# EasyEDA schematic ESP32 MATRIX ULN2002.json
TITLE: Sheet_1; REV: 1.0; Date: 2022-03-14; Sheet: 1/1; Drawn By: Toàn Nguyễn Văn; Company: Your Company
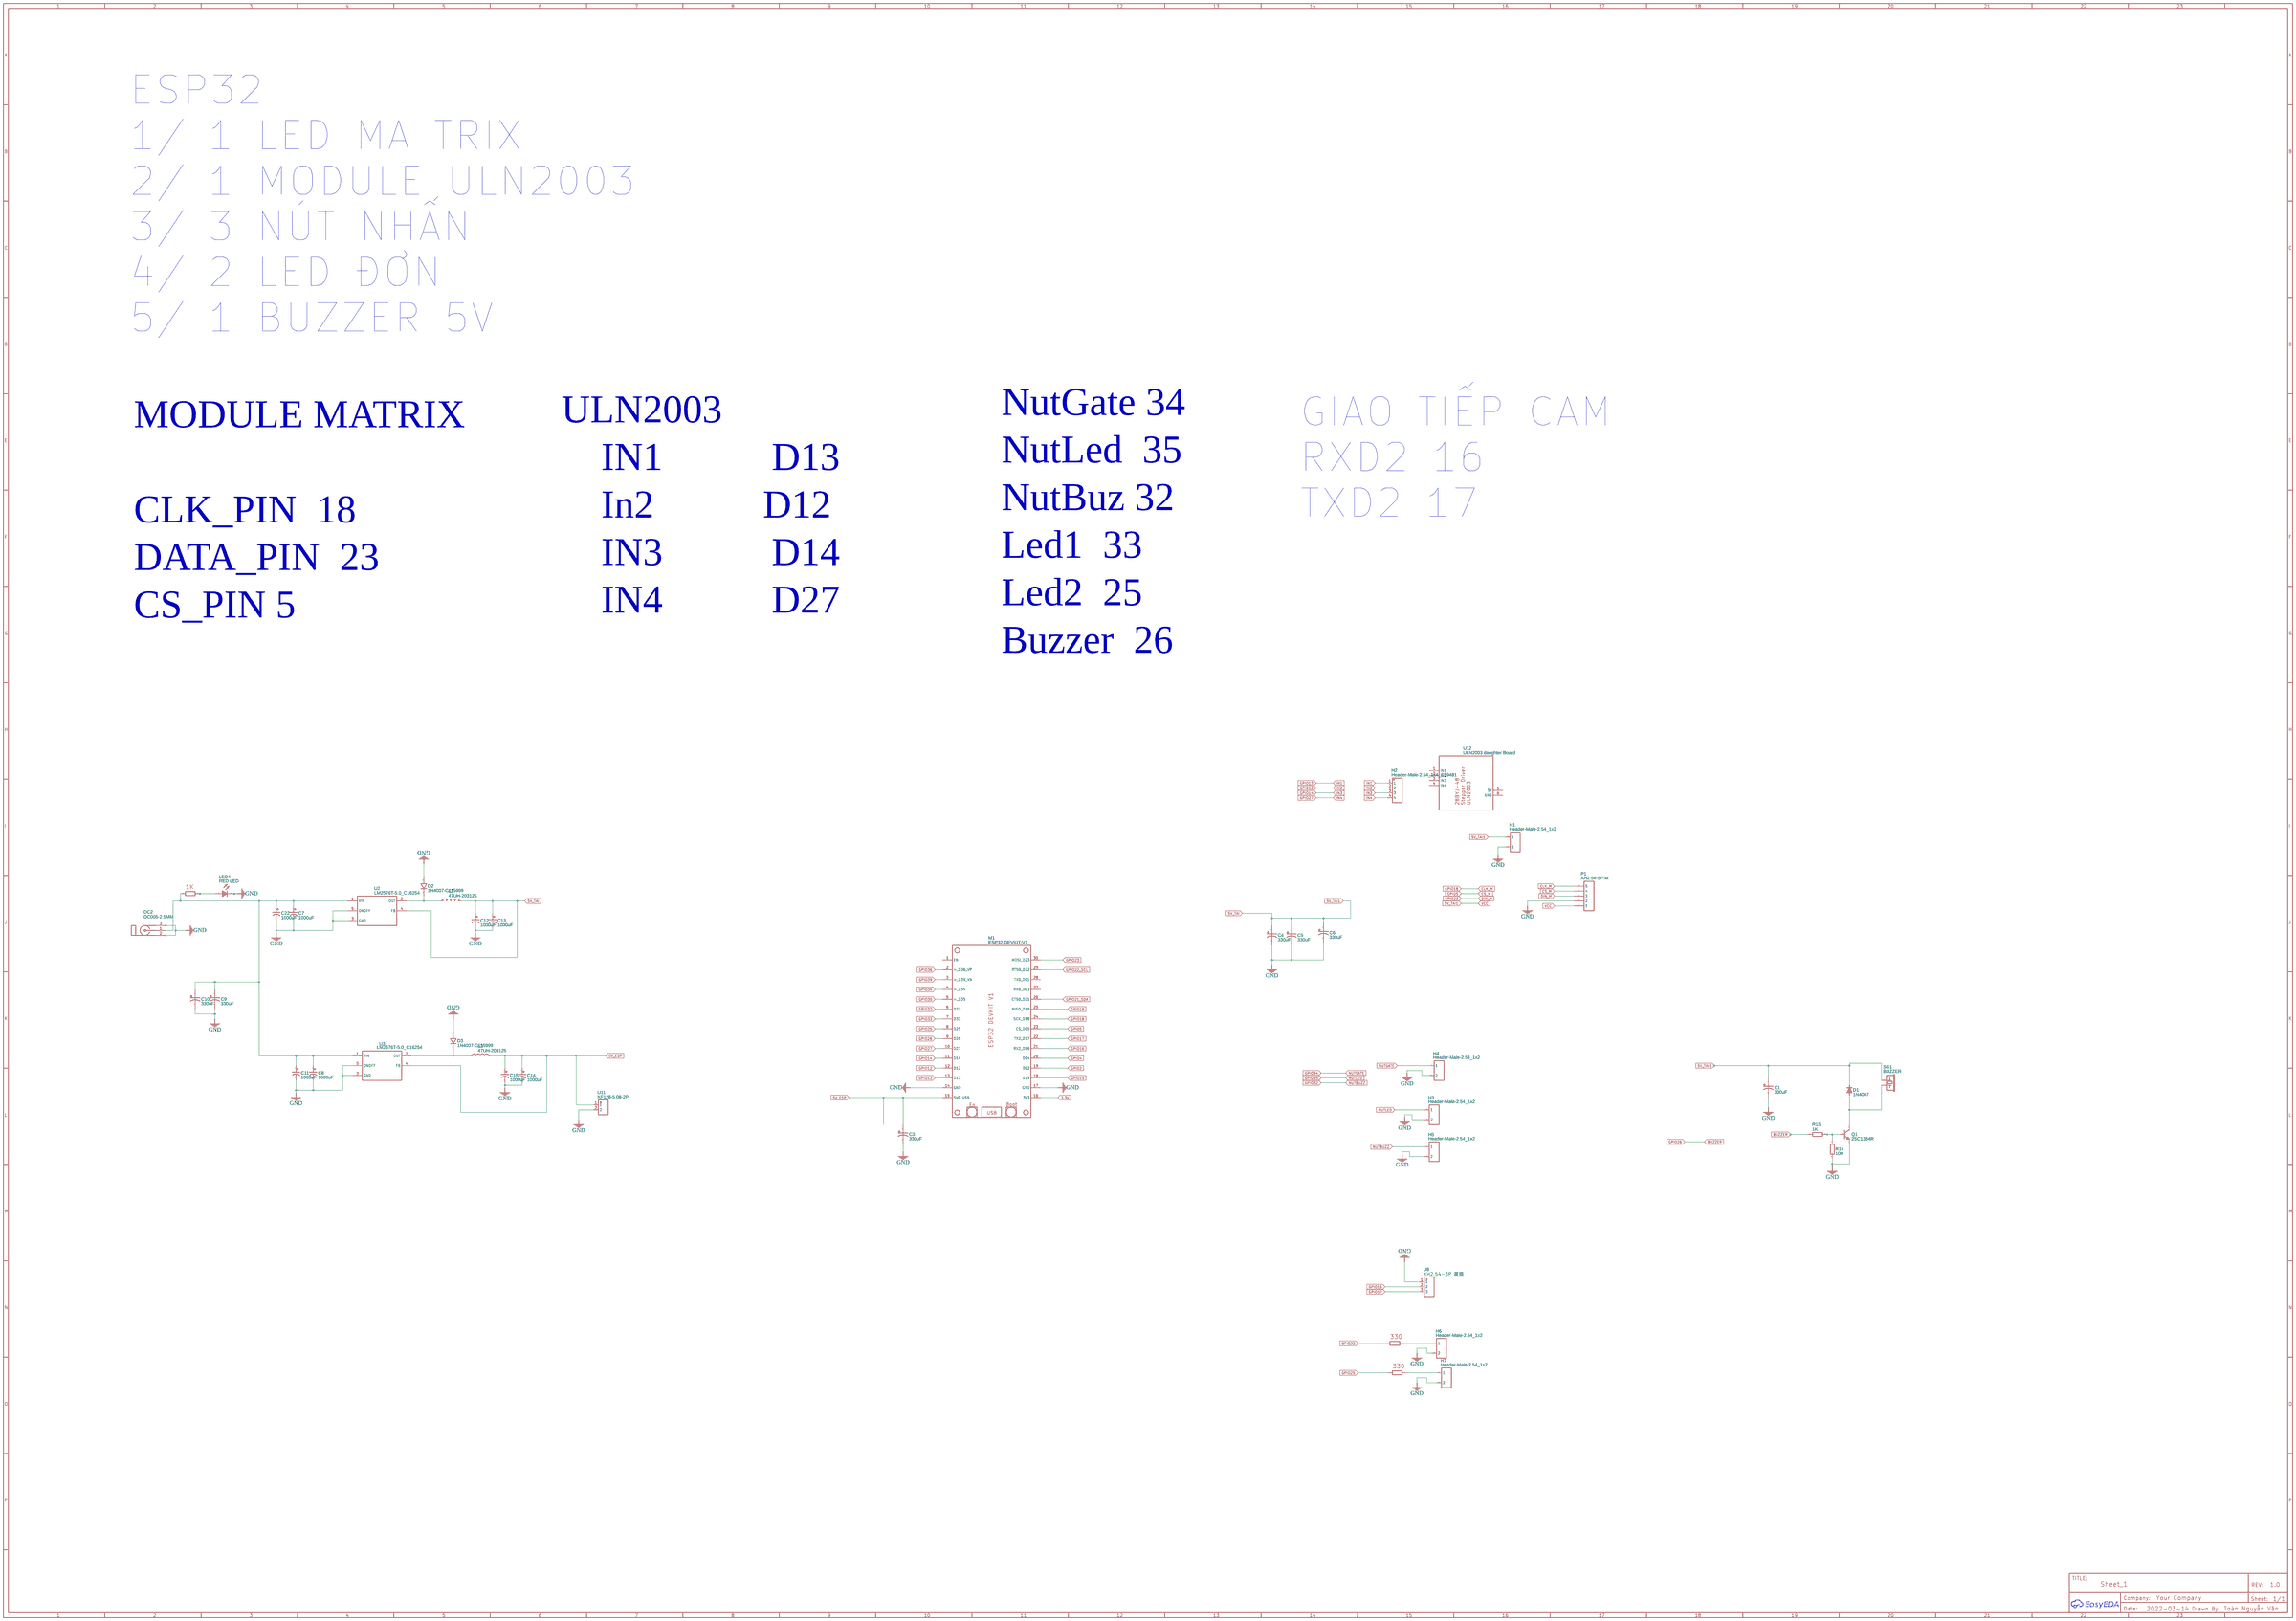
[diagram p0: schematic sheet]

## Parts
C1  330uF  [CAP-TH_BD8.0-P3.50-D0.6-FD]
C3  330uF  [CAP-TH_BD8.0-P3.50-D0.6-FD]
C4  330uF  [CAP-TH_BD8.0-P3.50-D0.6-FD]
C5  330uF  [CAP-TH_BD8.0-P3.50-D0.6-FD]
C6  330uF  [CAP-TH_BD8.0-P3.50-D0.6-FD]
C7  1000uF  [CAP-TH_BD8.0-P3.50-D0.5-FD]
C8  1000uF  [CAP-TH_BD8.0-P3.50-D0.5-FD]
C9  330uF  [CAP-TH_BD8.0-P3.50-D0.6-FD]
C10  330uF  [CAP-TH_BD8.0-P3.50-D0.6-FD]
C11  1000uF  [CAP-TH_BD8.0-P3.50-D0.5-FD]
C12  1000uF  [CAP-TH_BD8.0-P3.50-D0.5-FD]
C13  1000uF  [CAP-TH_BD8.0-P3.50-D0.5-FD]
C14  1000uF  [CAP-TH_BD8.0-P3.50-D0.5-FD]
C15  1000uF  [CAP-TH_BD8.0-P3.50-D0.5-FD]
C22  1000uF  [CAP-TH_BD8.0-P3.50-D0.5-FD]
D1  1N4007  [1N4007]
D2  1N4007-C115999  [DO-41_BD2.4-L4.7-P8.70-D0.9-RD]
D3  1N4007-C115999  [DO-41_BD2.4-L4.7-P8.70-D0.9-RD]
DC2  DC005-2.5MM  [DC-IN-TH_DC-005-20A]
H1  Header-Male-2.54_1x2  [HDR-TH_2P-P2.54-V-M-1]
H2  Header-Male-2.54_1x4_C59481  [HDR-TH_4P-P2.54-V-M]
H3  Header-Male-2.54_1x2  [HDR-TH_2P-P2.54-V-M-1]
H4  Header-Male-2.54_1x2  [HDR-TH_2P-P2.54-V-M-1]
H5  Header-Male-2.54_1x2  [HDR-TH_2P-P2.54-V-M-1]
H6  Header-Male-2.54_1x2  [HDR-TH_2P-P2.54-V-M-1]
H7  Header-Male-2.54_1x2  [HDR-TH_2P-P2.54-V-M-1]
L2  47UH-203125  [IND-TH_L24.6-W10.0-P8.85-D1.3]
L3  47UH-203125  [IND-TH_L24.6-W10.0-P8.85-D1.3]
LED4  RED LED  [LED-5MM-2.54MM]
M1  ESP32-DEVKIT-V1  [ESP32-DEVKIT-V1-MODULE]
P1  XH2.54-5P-M  [XH2.54-5P]
Q1  2SC1384R  [TO-92-3_L4.9-W3.7-P1.27-L]
R1  1K  [RESISTOR 1K OHM]
R2  1K  [RESISTOR 1K OHM]
R3  1K  [RESISTOR 1K OHM]
R14  10K  [RESISTOR 1K OHM]
R15  1K  [RESISTOR 1K OHM]
SG1  BUZZER  [BUZZER]
U2  LM2576T-5.0_C16254  [TO-220-5L_L10.2-W4.5-P1.71-L]
U3  LM2576T-5.0_C16254  [TO-220-5L_L10.2-W4.5-P1.71-L]
U8  XH2.54-3P 直插  [CONN-TH_XH2.54-3P]
U11  KF128-5.08-2P  [CONN-TH_P5.08_KF128-5.08-2P]
U12  ULN2003 daughter Board  [ULN2003 PCB]

## Library data of the parts
C1 C3-C6 C9 C10 = NXA 16V330 8*11.5: Supplier: LCSC; Supplier Part: C165541; Manufacturer: SamYoung Electronics; Contributor: LCSC; JLCPCB Part Class: Extended Part
C7 C8 C11-C15 C22 = 1000uF 16V 8*16: Supplier: LCSC; Manufacturer: ValuePro; Supplier Part: C43832; JLCPCB Part Class: Extended Part
D1 = 1N4007: Contributor: Srinivasan
D2 D3 = 1N4007-C115999: Supplier Part: C115999; Supplier: LCSC; Manufacturer: PANJIT; Manufacturer Part: 1N4007; Contributor: LCSC; JLCPCB Part Class: Extended Part
DC2 = DC005-2.5MM: Supplier: LCSC; Manufacturer: SOFNG; Supplier Part: C111573
H1 H3-H7 = Header-Male-2.54_1x2: Supplier: LCSC; Manufacturer: TE Connectivity; Manufacturer Part: 826629-2; Supplier Part: C86471; JLCPCB Part Class: Extended Part
H2 = Header-Male-2.54_1x4_C59481: Supplier: LCSC; Manufacturer: ReliaPro; Manufacturer Part: Headers  Pins 1*4P; Supplier Part: C59481
L2 L3 = 47UH-203125: Supplier: LCSC; Supplier Part: C9900004701; Manufacturer Part: 47uH-203125; JLCPCB Part Class: Extended Part; Contributor: LCSC
LED4 = RED LED: Supplier: LCSC; Manufacturer: EVERLIGHT; Manufacturer Part: 333-2SURD/S530-A3; Supplier Part: C87271
M1 = ESP32-DEVKIT-V1: Manufacturer Part: ESP32 Module - Doit.am; Contributor: Mike Matheson
P1 = XH2.54-5P-M: thegioiic.com: 4P-XH2.54-V; link: http://thegioiic.com/products/4p-xh2-54-v; Contributor: rakowski.hub
Q1 = 2SC1384R: Supplier: LCSC; Manufacturer: CJ; Supplier Part: C38830; JLCPCB Part Class: Extended Part
R1-R3 R14 R15 = resistor 10k ohm: Supplier Part: C348856; Manufacturer: ResistorToday; Manufacturer Part: EWWR0003J1K00T9; Contributor: Rio Anderson; JLCPCB Part Class: Extended Part
SG1 = BUZZER: Contributor: sohaibpannu
U2 U3 = LM2576T-5.0_C16254: Supplier: LCSC; Manufacturer: TI; Manufacturer Part: LM2576T-5.0; Supplier Part: C16254; JLCPCB Part Class: Extended Part
U8 = XH2.54-3P 直插: Supplier: LCSC; Supplier Part: C9900000727; Manufacturer: null; JLCPCB Part Class: Extended Part; Contributor: LCSC
U11 = KF128-5.08-2P: Supplier: LCSC; Supplier Part: C474952; Manufacturer: Cixi Kefa Elec; Contributor: LCSC; JLCPCB Part Class: Extended Part
U12 = ULN2003 daughter Board: Contributor: kniemann; Supplier Part: Ebay; Supplier: Unknown

## Nets
3.3V: M1.16(3V3)
5V_ESP: C3.1 C14.1 C15.1 L3.2 M1.15(5V0 USB) U3.4(FB) U11.1
5V_TAI: C1.1 C4.1 C5.1 C6.1 C12.1 C13.1 D1.K H1.1 L2.2 P1.1 SG1.+(1) U2.4(FB)
GND: C1.2 C3.2 C4.2 C5.2 C6.2 C7.2 C8.2 C9.2 C10.2 C11.2 C12.2 C13.2 C14.2 C15.2 C22.2 D2.2(A) D3.2(A) DC2.2 DC2.3 H1.2 H3.2 H4.2 H5.2 H6.2 H7.2 LED4.2(C) M1.14(GND) M1.17(GND) P1.2 Q1.1(E) R14.2 U2.3(GND) U2.5(ONOFF) U3.3(GND) U3.5(ONOFF) U8.1 U11.2
BUZZER: M1.9(D26) R15.1
CLK_M: M1.24(SCK D18) P1.5
CS_M: M1.23(CS D05) P1.4
DIN_M: M1.30(MOSI D23) P1.3
GPIO2: M1.19(D02)
GPIO4: M1.20(D04)
GPIO12: H2.2 M1.12(D12)
GPIO13: H2.1 M1.13(D13)
GPIO14: H2.3 M1.11(D14)
GPIO15: M1.18(D15)
GPIO16: M1.21(RX2 D16) U8.2
GPIO17: M1.22(TX2 D17) U8.3
GPIO19: M1.25(MISO D19)
GPIO21_SDA: M1.26(CTS0 D21)
GPIO22_SCL: M1.29(RTS0 D22)
GPIO25: M1.8(D25) R3.1
GPIO27: H2.4 M1.10(D27)
GPIO32: H5.1 M1.6(D32)
GPIO33: M1.7(D33) R1.1
GPIO34: H4.1 M1.4(> D34)
GPIO35: H3.1 M1.5(> D35)
GPIO36: M1.2(> D36 VP)
GPIO39: M1.3(> D39 VN)
Net-(C7-1): C7.1 C8.1 C9.1 C10.1 C11.1 C22.1 DC2.1(VCC) R2.1 U2.1(VIN) U3.1(VIN)
Net-(D1-A): D1.A Q1.2(C) SG1.-(2)
Net-(D2-1): D2.1(C) L2.1 U2.2(OUT)
Net-(D3-1): D3.1(C) L3.1 U3.2(OUT)
Net-(H6-1): H6.1 R1.2
Net-(H7-1): H7.1 R3.2
Net-(LED4-1): LED4.1(A) R2.2
Net-(Q1-3): Q1.3(B) R14.1 R15.2

Not connected (* = marked no-connect by the designer): M1 1(EN) 27(RX0 D03) 28(TX0 D01); U12 1(IN1) 2(IN2) 3(IN3) 4(IN4) 5(5V) 6(GND)

## Notes on the sheet
- ESP32
  1/ 1 LED MA TRIX
  2/ 1 MODULE ULN2003
  3/ 3 NÚT NHẤN
  4/ 2 LED ĐƠN
  5/ 1 BUZZER 5V
- NutGate 34
  NutLed  35
  NutBuz 32
  Led1  33
  Led2  25
  Buzzer  26
- ULN2003
      IN1           D13
      In2           D12
      IN3           D14
      IN4           D27
- GIAO TIẾP CAM
  RXD2 16
  TXD2 17
- MODULE MATRIX
  CLK_PIN  18
  DATA_PIN  23
  CS_PIN 5
